# Altium project BW0253.PrjPcb (part 2 of 2)
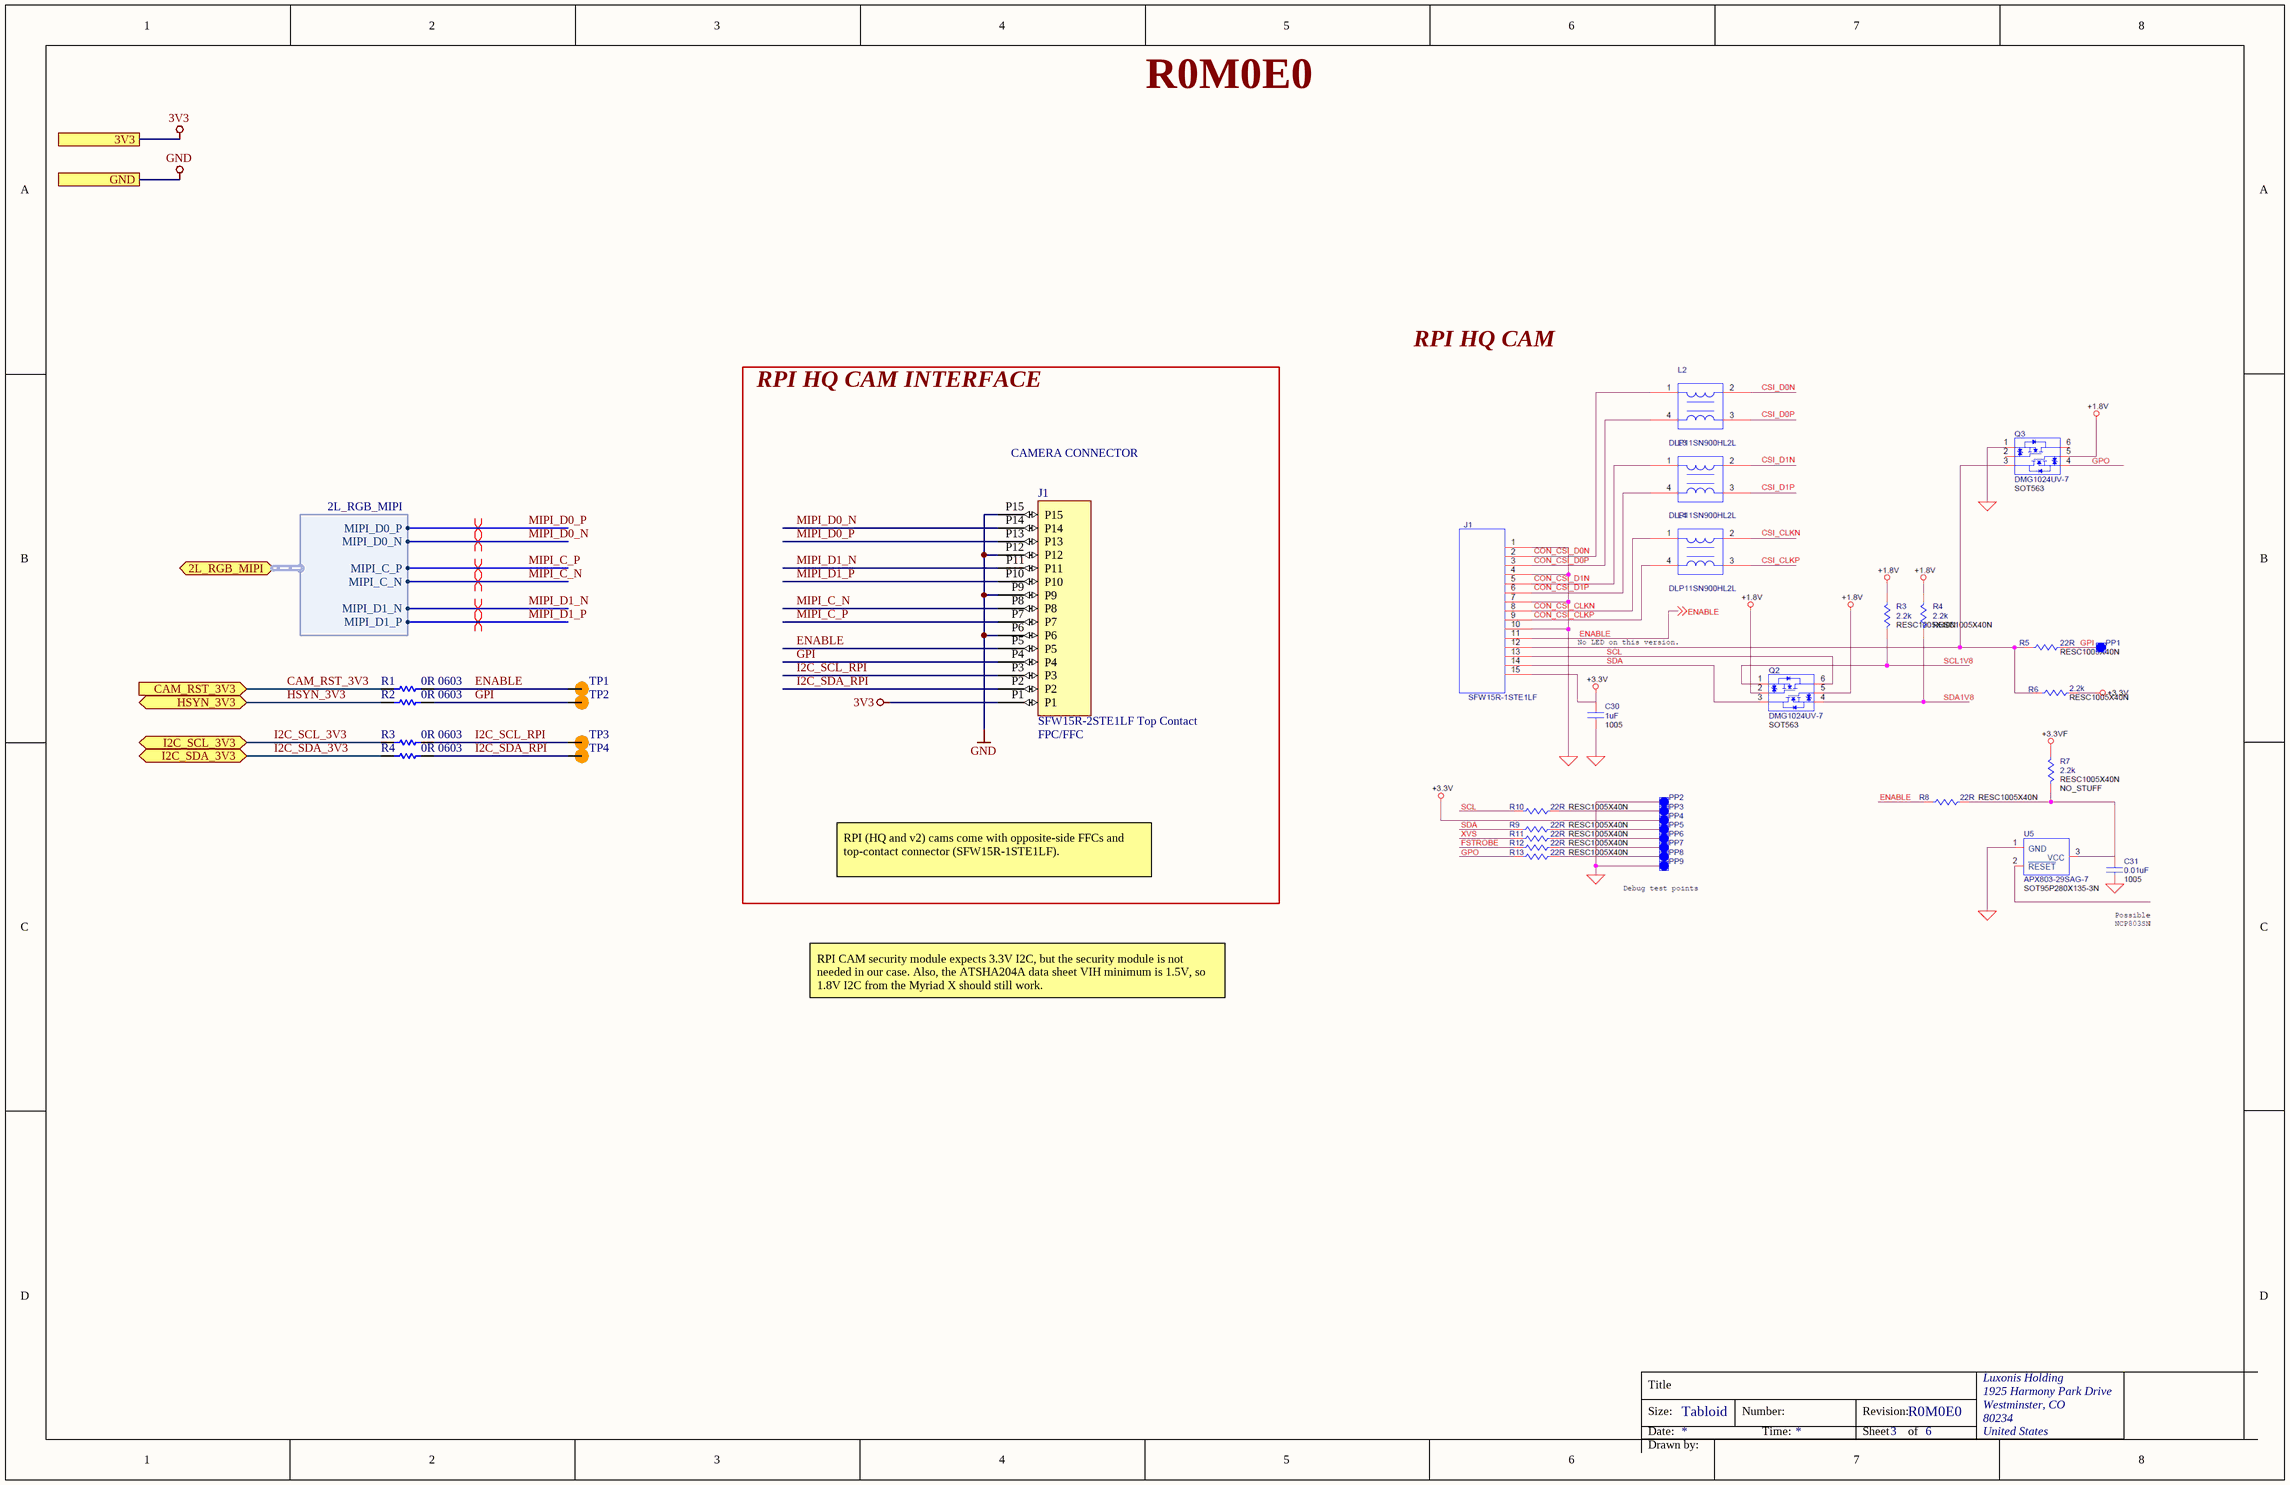
[diagram p6: RPI_CAM_INTERFACE.SchDoc]

## Nets that join several sheets
1V8: BW0253_POWER (C5.2 TP9.1 U2.5), BW0253_LEVEL_SHIFT (6 pins)
3V3: BW0253_POWER (8 pins), BW0253_LEVEL_SHIFT (C7.2 C9.2 U3.7 U4.7), RPI_CAM_INTERFACE (J1.P1)
GND: BW0253_POWER (11 pins), BW0253_LEVEL_SHIFT (6 pins), DEPTHAI_CAM_INTERFACE (10 pins), RPI_CAM_INTERFACE (J1.P6 J1.P9 J1.P12 J1.P15)
VDD_5V: BW0253_POWER (C1.2 U1.1 U1.2), DEPTHAI_CAM_INTERFACE (J2.25 J2.26)
AUX_IO1_1V8: BW0253_LEVEL_SHIFT (U3.4), DEPTHAI_CAM_INTERFACE (R10.2)
CAM_RST_1V8: BW0253_LEVEL_SHIFT (U3.5), DEPTHAI_CAM_INTERFACE (R9.2)
CAM_RST_3V3: BW0253_LEVEL_SHIFT (U3.8), RPI_CAM_INTERFACE (R1.1)
HSYN_3V3: BW0253_LEVEL_SHIFT (U3.1), RPI_CAM_INTERFACE (R2.1)
I2C_SCL_1V8: BW0253_LEVEL_SHIFT (U4.5), DEPTHAI_CAM_INTERFACE (R11.2)
I2C_SCL_3V3: BW0253_LEVEL_SHIFT (U4.8), RPI_CAM_INTERFACE (R3.1)
I2C_SDA_1V8: BW0253_LEVEL_SHIFT (U4.4), DEPTHAI_CAM_INTERFACE (R12.2)
I2C_SDA_3V3: BW0253_LEVEL_SHIFT (U4.1), RPI_CAM_INTERFACE (R4.1)
MIPI_C_N: DEPTHAI_CAM_INTERFACE (J2.9), RPI_CAM_INTERFACE (J1.P8)
MIPI_C_P: DEPTHAI_CAM_INTERFACE (J2.8), RPI_CAM_INTERFACE (J1.P7)
MIPI_D0_N: DEPTHAI_CAM_INTERFACE (J2.6), RPI_CAM_INTERFACE (J1.P14)
MIPI_D0_P: DEPTHAI_CAM_INTERFACE (J2.5), RPI_CAM_INTERFACE (J1.P13)
MIPI_D1_N: DEPTHAI_CAM_INTERFACE (J2.11), RPI_CAM_INTERFACE (J1.P11)
MIPI_D1_P: DEPTHAI_CAM_INTERFACE (J2.12), RPI_CAM_INTERFACE (J1.P10)

## Assembly variants
Production: all parts fitted